# Altium schematic sheet RaspiConnection.SchDoc
size A4; DocumentNumber: 1; SheetNumber: 1; SheetTotal: 4; RelSerie: X
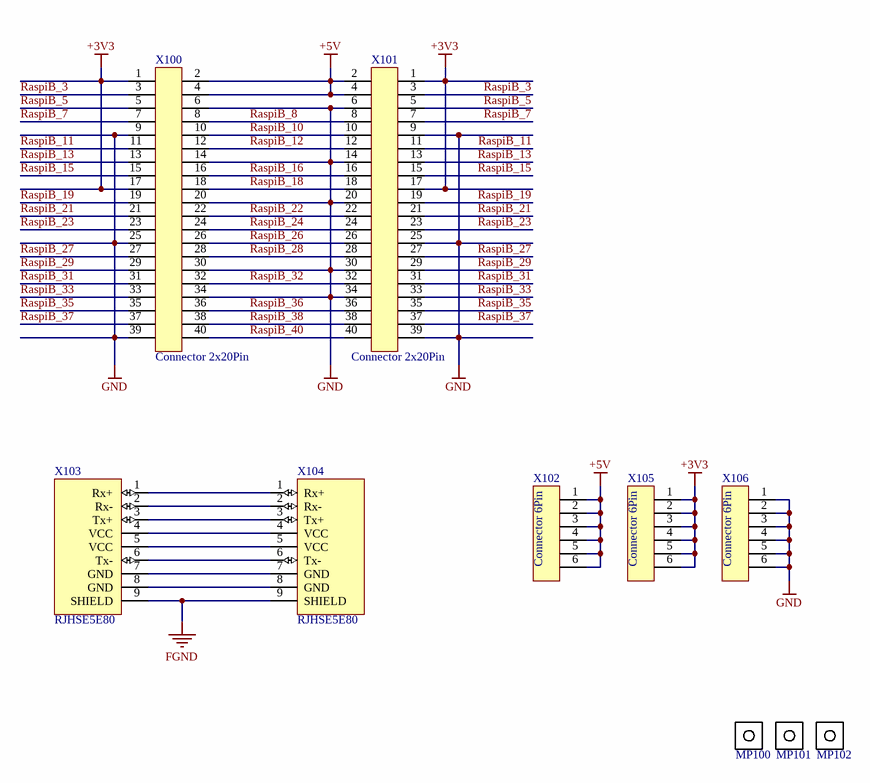
[diagram p0: RaspiConnection.SchDoc]

## Parts
MP100  Mounting Hole  [M3x08S]  (value not drawn)  (no BOM)
MP101  Mounting Hole  [M3x08S]  (value not drawn)  (no BOM)
MP102  Mounting Hole  [M3x08S]  (value not drawn)  (no BOM)
X100  Connector 2x20Pin  [Pin Header 2x20 TH Pitch 2.54mm - sh]
X101  Connector 2x20Pin  [Pin Header 2x20 SMD Pitch 2.54mm F]
X102  Connector 6Pin  [Pin Header 1x6 TH Pitch 2.54mm]
X103  RJHSE5E80  [RJ45]
X104  RJHSE5E80  [RJ45]
X105  Connector 6Pin  [Pin Header 1x6 TH Pitch 2.54mm]
X106  Connector 6Pin  [Pin Header 1x6 TH Pitch 2.54mm]

## Nets
+3V3: X100.1 X100.17 X101.1 X101.17 X105.1 X105.2 X105.3 X105.4 X105.5 X105.6
+5V: X100.2 X100.4 X101.2 X101.4 X102.1 X102.2 X102.3 X102.4 X102.5 X102.6
FGND: X103.9(SHIELD) X104.9(SHIELD)
GND: X100.6 X100.9 X100.14 X100.20 X100.25 X100.30 X100.34 X100.39 X101.6 X101.9 X101.14 X101.20 X101.25 X101.30 X101.34 X101.39 X106.1 X106.2 X106.3 X106.4 X106.5 X106.6
RaspiB_3: X100.3 X101.3
RaspiB_5: X100.5 X101.5
RaspiB_7: X100.7 X101.7
RaspiB_8: X100.8 X101.8
RaspiB_10: X100.10 X101.10
RaspiB_11: X100.11 X101.11
RaspiB_12: X100.12 X101.12
RaspiB_13: X100.13 X101.13
RaspiB_15: X100.15 X101.15
RaspiB_16: X100.16 X101.16
RaspiB_18: X100.18 X101.18
RaspiB_19: X100.19 X101.19
RaspiB_21: X100.21 X101.21
RaspiB_22: X100.22 X101.22
RaspiB_23: X100.23 X101.23
RaspiB_24: X100.24 X101.24
RaspiB_26: X100.26 X101.26
RaspiB_27: X100.27 X101.27
RaspiB_28: X100.28 X101.28
RaspiB_29: X100.29 X101.29
RaspiB_31: X100.31 X101.31
RaspiB_32: X100.32 X101.32
RaspiB_33: X100.33 X101.33
RaspiB_35: X100.35 X101.35
RaspiB_36: X100.36 X101.36
RaspiB_37: X100.37 X101.37
RaspiB_38: X100.38 X101.38
RaspiB_40: X100.40 X101.40
NetX103_1: X103.1(Rx+) X104.1(Rx+)
NetX103_2: X103.2(Rx-) X104.2(Rx-)
NetX103_3: X103.3(Tx+) X104.3(Tx+)
NetX103_4: X103.4(VCC) X104.4(VCC)
NetX103_5: X103.5(VCC) X104.5(VCC)
NetX103_6: X103.6(Tx-) X104.6(Tx-)
NetX103_7: X103.7(GND) X104.7(GND)
NetX103_8: X103.8(GND) X104.8(GND)

## Notes on the sheet
- Bezeichnung:
- Printnummer:
- Filename:
- Format:
- Blatt:
- Erstellt:
- Erst. Datum:
- Freigegeben:
- Serie
- Prototyp
- Entwicklung
- A4
- Nummer:
- Geprüft
- Geprüft Datum:
- Index:

## Library data of the parts
MP100-MP102 = MP_Mounting Hole: Different Mounting holes
X100 = X_Connector 2x20Pin: Generic connector 2x20 Pin
X101 = X_Connector 2x20Pin_1: Generic connector 2x20 Pin
X102 X105 X106 = X_Connector 6Pin: Generic connector 6 Pin
X103 X104 = X_RJHSE5E80: Modular Connectors / Ethernet Connectors High Speed RJ w/no LED's or Shield; Manufacturer 1: Amphenol Commercial; Voltage Rating: 125V; Manufacturer Part Number 1: RJHSE5E80; Termination: Solder; ComponentLink1URL: http://www.mouser.com/ds/2/18/Amphenol_RJHSE_BRO-311217.pdf; ComponentLink1Description: http://www.mouser.com/ds/2/18/Amphenol_RJHSE_BRO-311217.pdf; ComponentLink2URL: https://www.amphenolcanada.com/ProductSearch/pdf/RJHSE_BRO.pdf; ComponentLink2Description: https://www.amphenolcanada.com/ProductSearch/pdf/RJHSE_BRO.pdf; Supplier 1: Digi-Key; Supplier Part Number 1: RJHSE5E80-ND; ComponentLink3URL: https://datasheet.ciiva.com/16408/eng-cd-6368150-b1-16408714.pdf; ComponentLink3Description: https://datasheet.ciiva.com/16408/eng-cd-6368150-b1-16408714.pdf; ComponentLink4URL: https://datasheet.ciiva.com/30494/0900766b8121d3d0-30494389.pdf; ComponentLink4Description: https://datasheet.ciiva.com/30494/0900766b8121d3d0-30494389.pdf; ComponentLink5URL: https://datasheet.ciiva.com/30086/63681501-30086239.pdf; ComponentLink5Description: https://datasheet.ciiva.com/30086/63681501-30086239.pdf; ComponentLink7URL: https://datasheet.ciiva.com/685/eng-cd-6368150-c1-685799.pdf; ComponentLink7Description: https://datasheet.ciiva.com/685/eng-cd-6368150-c1-685799.pdf